# EAGLE design openrfid (EAGLE 6.2)
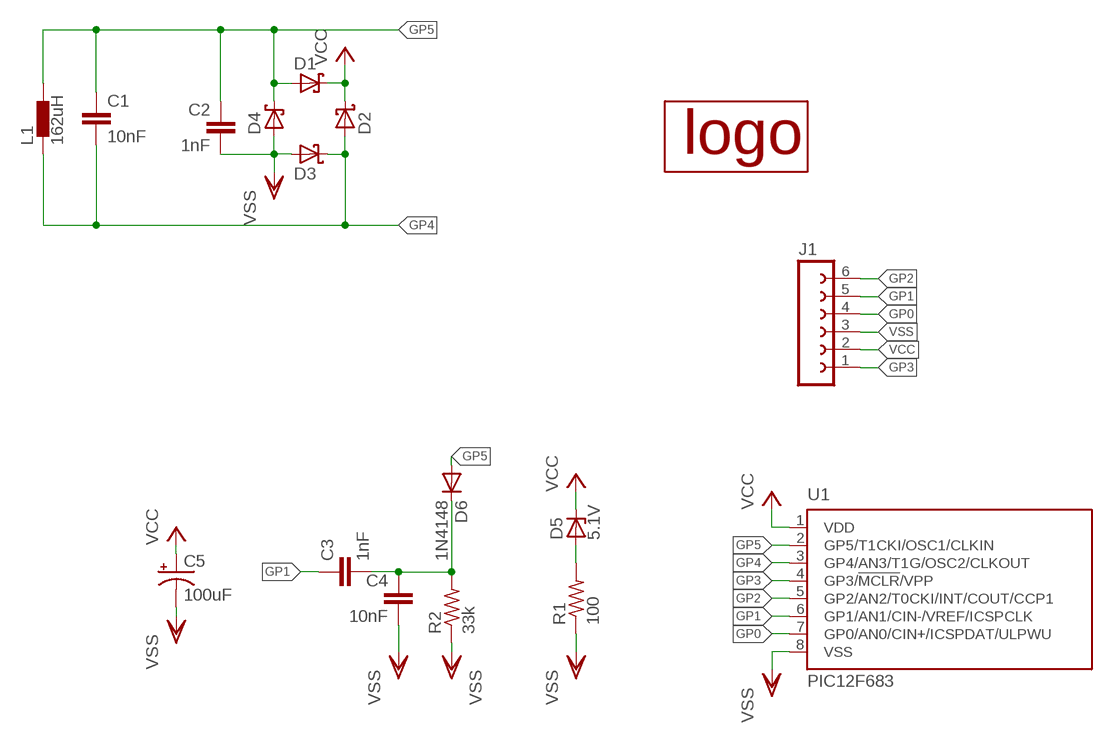
[diagram p0: schematic, sheet 1]

## Parts
C1  10nF  C-EU050-024X044  [C050-024X044]
C2  1nF  C-EU025-024X044  [C025-024X044]
C3  1nF  C-EU025-024X044  [C025-024X044]
C4  10nF  C-EU050-024X044  [C050-024X044]
C5  100uF  CPOL-USE2,5-6E  [E2,5-6E]
D1  1N5817-B  [DO41-7.6]
D2  1N5817-B  [DO41-7.6]
D3  1N5817-B  [DO41-7.6]
D4  1N5817-B  [DO41-7.6]
D5  5.1V  ZENER-DIODEZD-5  [ZDIO-5]
D6  1N4148  1N4148DO35-7  [DO35-7]
J1  FE06-1  [FE06]
L1  162uH  BL02RN2  [BL02RN2]
R1  100  R-US_0204/7  [0204/7]
R2  33k  R-US_0204/7  [0204/7]
U1  PIC12F683  PIC12F683P  [DIL8]
U$1  KBELOGO-SILK  [KBELOGO-SILK]

## Nets
GP0: J1.4 U1.7(GP0/AN0/CIN+/ICSPDAT/ULPWU)
GP1: C3.1 J1.5 U1.6(GP1/AN1/CIN-/VREF/ICSPCLK)
GP2: J1.6 U1.5(GP2/AN2/T0CKI/INT/COUT/CCP1)
GP3: J1.1 U1.4(GP3/!MCLR!/VPP)
GP4: C1.2 D2.A D3.C L1.1 U1.3(GP4/AN3/T1G/OSC2/CLKOUT)
GP5: C1.1 C2.1 D1.A D4.C D6.A L1.2 U1.2(GP5/T1CKI/OSC1/CLKIN)
N$23: D5.A R1.2
N$26: C3.2 C4.1 D6.C R2.2
VCC: C5.+ D1.C D2.C D5.C J1.2 U1.1(VDD)
VSS: C2.2 C4.2 C5.- D3.A D4.A J1.3 R1.1 R2.1 U1.8(VSS)

## Library data of the parts
C1-C4 = rcl:C-EU: CAPACITOR, European symbol
C5 = rcl:CPOL-US: POLARIZED CAPACITOR, American symbol
D1-D4 = diode:1N581*: 1.0A SCHOTTKY BARRIER RECTIFIER Source: http://www.diodes.com/datasheets/ds23001.pdf
D5 = diode:ZENER-DIODE: Z-Diode
D6 = diode:1N4148: DIODE high speed (Philips)
J1 = con-lsta:FE06-1: FEMALE HEADER; OC_FARNELL: unknown; OC_NEWARK: unknown
L1 = inductors:BL0: Noise Suppression Products/EMI Suppression Filters, Lead EMIFIL(R) Inductor Type Source: http://www.murata.com .. BL01RN1_DS.pdf
R1 R2 = rcl:R-US_: RESISTOR, American symbol
U1 = microchip:PIC12F683: 8-Pin Flash-Based, 8-Bit CMOS Microcontrollers with nanoWatt Technology Source: http://ww1.microchip.com/downloads/en/DeviceDoc/41211D_.pdf; MF: MICROCHIP; MPN: PIC12F683-I/P; OC_FARNELL: 9759034; OC_NEWARK: 89H0442
U$1 = cuslibrary:KBELOGO-SILK

## Board
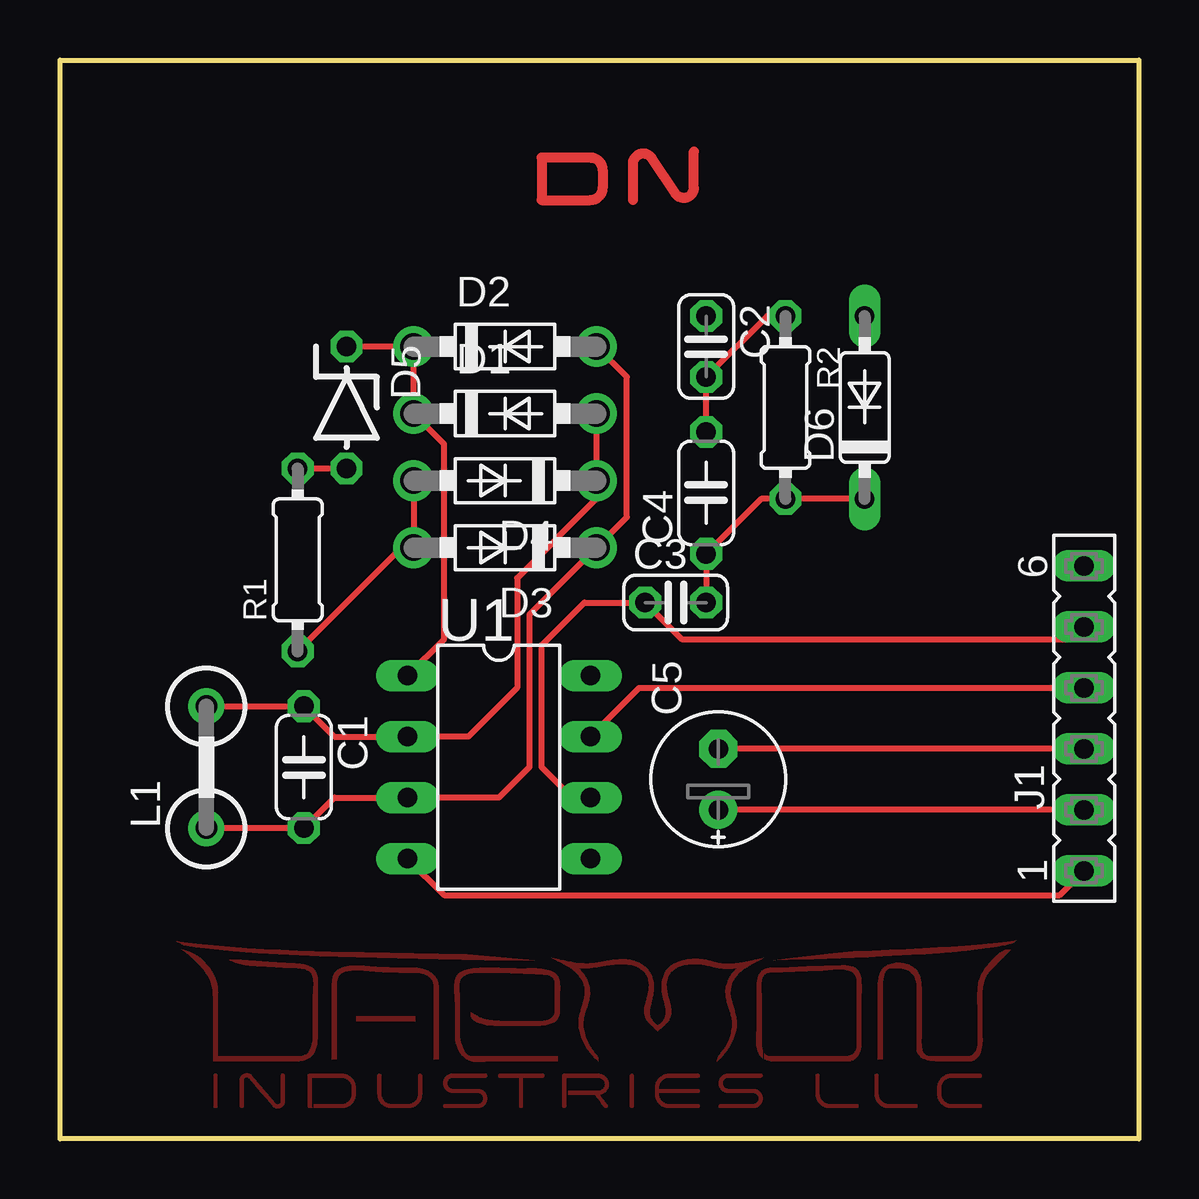
[diagram p1: board, top side]
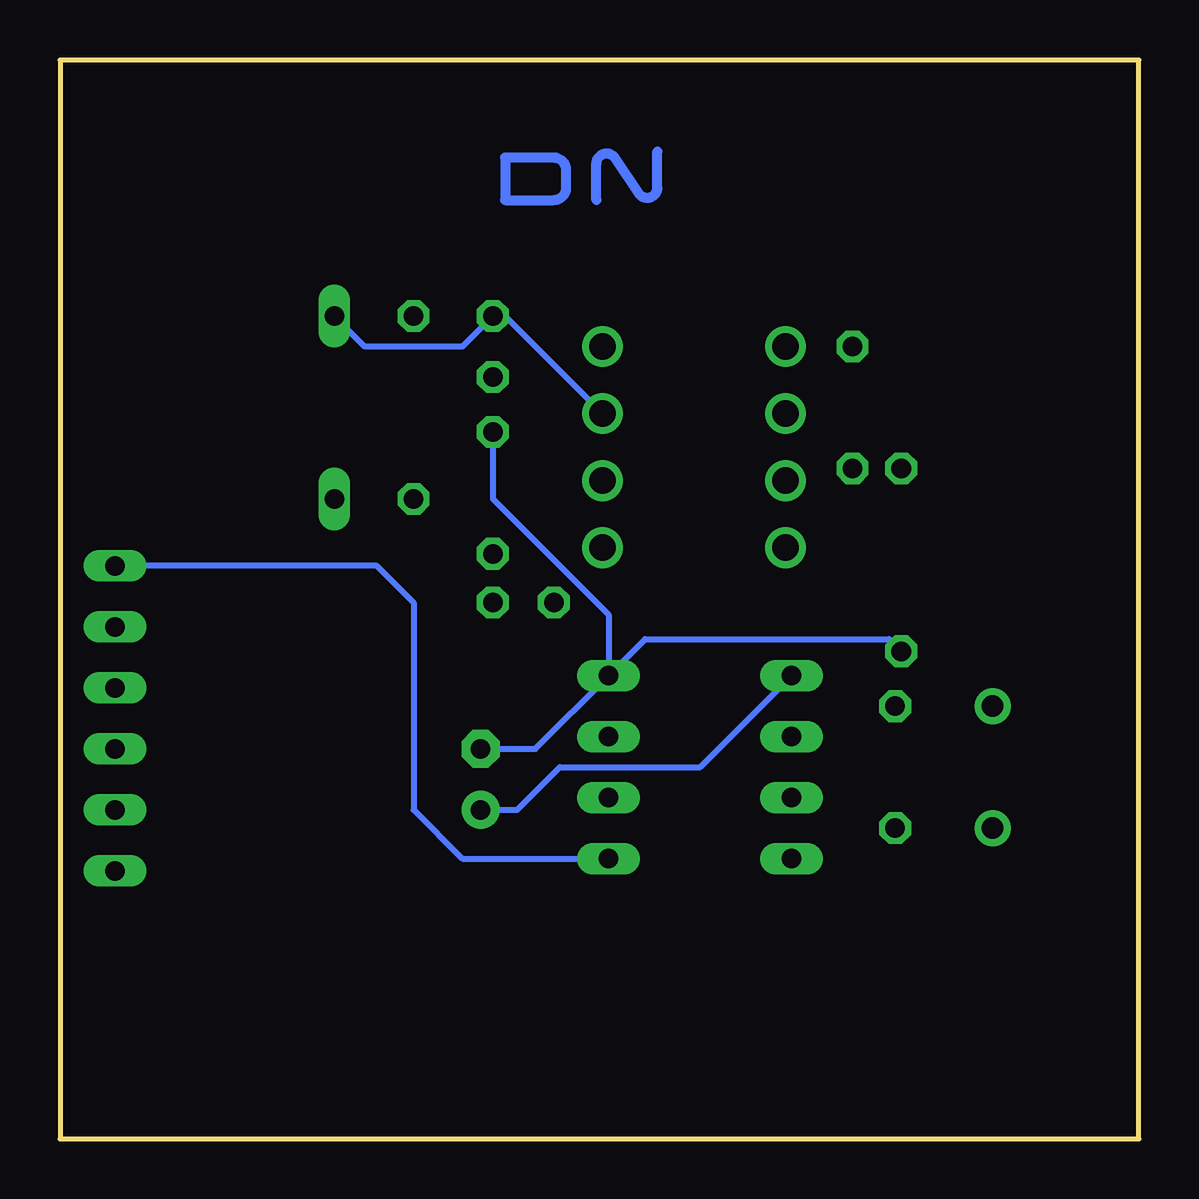
[diagram p2: board, bottom side, seen from below]

Size 44.96 x 44.96 mm. Coordinates in mm from the lower left corner, seen from the top.
Outline: 0,0 0,44.96 44.96,44.96 44.96,0 0,0
Copper layers (1*16): Top 0.035mm / dielectric 1.5mm / Bottom 0.035mm
Design rules: minimum track width 10mil, minimum drill 24mil, track to track 8mil, track to pad 8mil, pad to pad 8mil, via to via 8mil, smd to smd 8mil, copper to edge 40mil, drill to drill 8mil, minimum pad ring 10mil, minimum via ring 8mil, stop-mask expansion 4mil, vias tented up to drill 0mil, thermal gap 10mil

### Footprints (pad centres in the part's own frame; a part is rotated, then mirrored left to right if it is on the bottom)
C050-024X044 = drill 0.813 octagon: 1 -2.54,0; 2 2.54,0
C025-024X044 = drill 0.813 octagon: 1 -1.27,0; 2 1.27,0
E2,5-6E = drill 0.813 pad 1.575: + -1.27,0 | drill 0.813 pad 1.575 octagon: - 1.27,0
DO41-7.6 = drill 1.1 pad 1.7: A 3.81,0; C -3.81,0
ZDIO-5 = drill 0.813 octagon: A 2.54,0; C -2.54,0
DO35-7 = drill 0.813 long: A 3.81,0; C -3.81,0
FE06 = drill 0.813 long: 1 -6.35,0; 2 -3.81,0; 3 -1.27,0; 4 1.27,0; 5 3.81,0; 6 6.35,0
BL02RN2 = drill 0.9 pad 1.5: 1 -2.54,0; 2 2.54,0
0204/7 = drill 0.813 octagon: 1 -3.81,0; 2 3.81,0
DIL8 = drill 0.813 long: 1 -3.81,-3.81; 2 -1.27,-3.81; 3 1.27,-3.81; 4 3.81,-3.81; 5 3.81,3.81; 6 1.27,3.81; 7 -1.27,3.81; 8 -3.81,3.81

### Placement (x,y rotation side)
C1  10.16,15.49 270 top
C2  26.92,33.02 270 top
C3  25.65,22.35 0 top
C4  26.92,26.92 90 top
C5  27.43,14.99 90 top
D1  18.54,30.23 0 top
D2  18.54,33.02 0 top
D3  18.54,24.64 180 top
D4  18.54,27.43 180 top
D5  11.94,30.48 270 top
D6  33.53,30.48 90 top
J1  42.67,17.53 90 top
L1  6.1,15.49 90 top
R1  9.91,24.13 90 top
R2  30.23,30.48 270 top
U1  18.29,15.49 270 top
U$1  26.42,3.3 0 bottom

### Tracks (layer width: path | path; a pad name or v marks a point on that pad's centre or on a via)
GP0
  Top 0.254: U1.7 24.13,18.8 J1.4
GP1
  Top 0.254: U1.6 21.34,14.22 20.07,15.49 20.07,20.57 21.84,22.35 C3.1 25.91,20.83 42.16,20.83 J1.5
GP2
  Bottom 0.254: U1.5 28.19,11.68 30.23,13.72 30.23,22.35 31.75,23.88 J1.6
GP3
  Top 0.254: U1.4 16,10.16 41.66,10.16 J1.1
GP4
  Top 0.254: D2.A 23.62,31.75 23.62,25.91 D3.C 19.56,21.84 19.56,15.49 18.29,14.22 U1.3 11.43,14.22 C1.2 L1.1
GP5
  Top 0.254: D1.A D4.C 22.35,26.67 19.05,23.37 19.05,18.8 17.02,16.76 U1.2 11.43,16.76 C1.1 L1.2
  Bottom 0.254: D6.A 32.26,33.02 28.19,33.02 C2.1 26.42,34.29 D1.A
N$1
  pour Top: 6.49,2.71 6.48,2.71 6.47,2.71 6.47,2.71 6.46,2.71 6.46,2.71 6.45,2.71 6.45,2.71 6.44,2.7 6.44,2.7 6.43,2.7 6.43,2.69 6.43,2.69 6.42,2.69 6.42,2.68 6.42,2.68 6.41,2.67 6.41,2.67 6.41,2.67 6.41,2.66 6.41,2.66 6.4,2.65 6.4,2.64 6.4,1.36 6.4,1.36 6.41,1.35 6.41,1.35 6.41,1.34 6.41,1.34 6.41,1.34 6.41,1.33 6.42,1.33 6.42,1.32 6.42,1.32 6.43,1.31 6.43,1.31 6.43,1.31 6.44,1.31 6.44,1.3 6.45,1.3 6.45,1.3 6.46,1.3 6.46,1.29 6.47,1.29 6.47,1.29 6.48,1.29 6.49,1.29 6.49,1.29 6.5,1.29 6.5,1.29 6.51,1.3 6.51,1.3 6.52,1.3 6.52,1.3 6.53,1.31 6.53,1.31 6.53,1.31 6.54,1.31 6.54,1.32 6.54,1.32 6.55,1.33 6.55,1.33 6.55,1.34 6.55,1.34 6.56,1.34 6.56,1.35 6.56,1.35 6.56,1.36 6.56,1.36 6.56,2.64 6.56,2.65 6.56,2.65 6.56,2.66 6.56,2.66 6.55,2.67 6.55,2.67 6.55,2.67 6.55,2.68 6.54,2.68 6.54,2.69 6.53,2.69 6.53,2.7 6.53,2.7 6.52,2.7 6.52,2.71 6.51,2.71 6.51,2.71 6.5,2.71 6.5,2.71 6.49,2.71
N$2
  pour Top: 345 corners
N$3
  pour Top: 270 corners
N$4
  pour Top: 433 corners
N$5
  pour Top: 20.11,2.71 18.33,2.71 18.32,2.71 18.32,2.71 18.31,2.71 18.31,2.71 18.3,2.71 18.3,2.71 18.29,2.7 18.29,2.7 18.29,2.7 18.28,2.69 18.27,2.69 18.27,2.68 18.27,2.68 18.27,2.67 18.26,2.67 18.26,2.67 18.26,2.66 18.26,2.66 18.26,2.65 18.26,2.65 18.26,2.64 18.26,2.63 18.26,2.62 18.26,2.62 18.26,2.61 18.26,2.61 18.26,2.61 18.26,2.6 18.27,2.6 18.27,2.59 18.27,2.59 18.27,2.58 18.28,2.58 18.29,2.57 18.29,2.57 18.29,2.57 18.3,2.56 18.3,2.56 18.31,2.56 18.31,2.56 18.32,2.56 18.32,2.56 18.33,2.56 19.13,2.56 19.13,1.36 19.13,1.36 19.13,1.35 19.13,1.35 19.13,1.34 19.13,1.34 19.13,1.34 19.14,1.33 19.14,1.33 19.14,1.32 19.15,1.32 19.15,1.31 19.15,1.31 19.16,1.31 19.16,1.31 19.17,1.3 19.17,1.3 19.18,1.3 19.18,1.29 19.19,1.29 19.19,1.29 19.2,1.29 19.21,1.29 19.22,1.29 19.22,1.29 19.23,1.29 19.23,1.3 19.24,1.3 19.24,1.3 19.24,1.3 19.25,1.31 19.25,1.31 19.26,1.31 19.26,1.31 19.26,1.32 19.27,1.32 19.27,1.33 19.27,1.33 19.28,1.34 19.28,1.34 19.28,1.34 19.28,1.35 19.28,1.35 19.28,1.36 19.28,1.36 19.28,2.56 20.11,2.56 20.12,2.56 20.12,2.56 20.13,2.56 20.13,2.56 20.14,2.56 20.14,2.56 20.15,2.57 20.15,2.57 20.16,2.57 20.16,2.58 20.16,2.58 20.17,2.58 20.17,2.59 20.17,2.59 20.18,2.6 20.18,2.6 20.18,2.61 20.18,2.61 20.18,2.62 20.18,2.62 20.19,2.63 20.19,2.64 20.18,2.65 20.18,2.65 20.18,2.66 20.18,2.66 20.18,2.67 20.18,2.67 20.18,2.67 20.17,2.68 20.17,2.68 20.17,2.69 20.16,2.69 20.16,2.69 20.16,2.7 20.15,2.7 20.15,2.7 20.14,2.71 20.14,2.71 20.13,2.71 20.13,2.71 20.12,2.71 20.12,2.71
N$6
  pour Top: 23.83,2.71 23.82,2.71 23.81,2.71 23.81,2.71 23.8,2.71 23.8,2.71 23.79,2.71 23.79,2.71 23.79,2.7 23.78,2.7 23.78,2.7 23.77,2.69 23.77,2.69 23.76,2.68 23.76,2.68 23.76,2.67 23.75,2.67 23.75,2.67 23.75,2.66 23.75,2.66 23.75,2.65 23.75,2.65 23.75,2.64 23.75,1.36 23.75,1.36 23.75,1.35 23.75,1.35 23.75,1.34 23.75,1.34 23.75,1.34 23.76,1.33 23.76,1.33 23.76,1.32 23.77,1.32 23.77,1.31 23.77,1.31 23.78,1.31 23.78,1.31 23.79,1.3 23.79,1.3 23.8,1.3 23.8,1.29 23.81,1.29 23.81,1.29 23.82,1.29 23.83,1.29 23.84,1.29 23.84,1.29 23.85,1.29 23.85,1.3 23.86,1.3 23.86,1.3 23.86,1.3 23.87,1.31 23.87,1.31 23.88,1.31 23.88,1.31 23.88,1.32 23.89,1.32 23.89,1.33 23.89,1.33 23.9,1.34 23.9,1.34 23.9,1.34 23.9,1.35 23.9,1.35 23.9,1.36 23.9,1.36 23.9,2.64 23.9,2.65 23.9,2.65 23.9,2.66 23.9,2.66 23.9,2.67 23.9,2.67 23.89,2.67 23.89,2.68 23.89,2.68 23.88,2.69 23.88,2.69 23.88,2.69 23.87,2.7 23.87,2.7 23.86,2.7 23.86,2.71 23.86,2.71 23.85,2.71 23.85,2.71 23.84,2.71 23.84,2.71
N$7
  pour Top: 316 corners
N$8
  pour Top: 426 corners
N$9
  pour Top: 33.2,1.45 32.06,1.45 32.04,1.45 32.03,1.45 32.01,1.45 32,1.45 31.99,1.46 31.97,1.46 31.96,1.46 31.95,1.47 31.93,1.47 31.92,1.48 31.91,1.48 31.89,1.49 31.88,1.49 31.87,1.5 31.86,1.51 31.85,1.51 31.82,1.53 31.81,1.54 31.8,1.55 31.79,1.56 31.78,1.57 31.77,1.58 31.76,1.58 31.75,1.59 31.74,1.61 31.73,1.62 31.73,1.63 31.72,1.64 31.71,1.65 31.7,1.66 31.7,1.67 31.69,1.68 31.68,1.7 31.68,1.71 31.67,1.72 31.67,1.74 31.66,1.75 31.66,1.76 31.66,1.78 31.65,1.8 31.65,1.82 31.65,1.83 31.65,1.85 31.65,1.86 31.65,2.64 31.64,2.65 31.64,2.66 31.64,2.66 31.64,2.67 31.64,2.67 31.64,2.67 31.63,2.68 31.63,2.68 31.63,2.69 31.62,2.69 31.61,2.7 31.61,2.7 31.61,2.7 31.6,2.71 31.6,2.71 31.59,2.71 31.59,2.71 31.58,2.71 31.58,2.71 31.57,2.71 31.56,2.71 31.56,2.71 31.55,2.71 31.55,2.71 31.54,2.71 31.54,2.71 31.53,2.71 31.53,2.7 31.52,2.7 31.52,2.7 31.52,2.69 31.51,2.69 31.51,2.69 31.5,2.68 31.5,2.68 31.5,2.67 31.5,2.67 31.5,2.67 31.49,2.66 31.49,2.66 31.49,2.65 31.49,2.65 31.49,2.64 31.49,1.86 31.49,1.84 31.49,1.82 31.49,1.8 31.5,1.78 31.5,1.74 31.51,1.72 31.52,1.7 31.52,1.68 31.53,1.67 31.54,1.63 31.55,1.61 31.56,1.6 31.57,1.58 31.58,1.56 31.59,1.55 31.6,1.53 31.61,1.52 31.62,1.51 31.63,1.49 31.65,1.48 31.67,1.45 31.69,1.44 31.7,1.43 31.72,1.41 31.73,1.4 31.75,1.39 31.76,1.38 31.78,1.37 31.79,1.36 31.81,1.35 31.83,1.35 31.85,1.34 31.86,1.33 31.88,1.32 31.9,1.32 31.92,1.31 31.94,1.31 31.97,1.3 31.99,1.3 32.01,1.3 32.03,1.29 32.05,1.29 33.2,1.29 33.2,1.29 33.21,1.29 33.21,1.29 33.22,1.3 33.23,1.3 33.23,1.3 33.23,1.31 33.24,1.31 33.24,1.31 33.25,1.31 33.25,1.32 33.25,1.32 33.26,1.33 33.26,1.33 33.26,1.34 33.26,1.34 33.27,1.34 33.27,1.35 33.27,1.35 33.27,1.36 33.27,1.36 33.27,1.38 33.27,1.38 33.27,1.39 33.27,1.39 33.27,1.4 33.26,1.4 33.26,1.41 33.26,1.41 33.26,1.41 33.25,1.42 33.25,1.42 33.25,1.43 33.24,1.43 33.24,1.43 33.23,1.44 33.23,1.44 33.23,1.44 33.22,1.44 33.21,1.45 33.21,1.45 33.2,1.45
N$10
  pour Top: 35.66,1.45 34.52,1.45 34.5,1.45 34.49,1.45 34.47,1.45 34.46,1.45 34.44,1.46 34.43,1.46 34.42,1.46 34.4,1.47 34.39,1.47 34.38,1.48 34.37,1.48 34.35,1.49 34.34,1.49 34.33,1.5 34.32,1.51 34.3,1.51 34.29,1.52 34.28,1.53 34.27,1.54 34.26,1.55 34.25,1.56 34.24,1.57 34.23,1.58 34.22,1.58 34.21,1.59 34.2,1.61 34.19,1.62 34.18,1.63 34.18,1.64 34.17,1.65 34.16,1.66 34.15,1.67 34.15,1.68 34.14,1.7 34.14,1.71 34.13,1.72 34.13,1.74 34.12,1.75 34.12,1.76 34.11,1.78 34.11,1.8 34.11,1.82 34.11,1.83 34.1,1.85 34.1,1.86 34.1,2.64 34.1,2.65 34.1,2.65 34.1,2.66 34.1,2.66 34.1,2.67 34.1,2.67 34.09,2.67 34.09,2.68 34.09,2.68 34.08,2.69 34.08,2.69 34.07,2.7 34.07,2.7 34.07,2.7 34.06,2.71 34.06,2.71 34.05,2.71 34.05,2.71 34.04,2.71 34.04,2.71 34.03,2.71 34.02,2.71 34.02,2.71 34.01,2.71 34.01,2.71 34,2.71 34,2.71 33.99,2.71 33.99,2.7 33.98,2.7 33.98,2.7 33.97,2.69 33.97,2.69 33.97,2.69 33.96,2.68 33.96,2.68 33.96,2.67 33.96,2.67 33.95,2.67 33.95,2.66 33.95,2.66 33.95,2.65 33.95,2.65 33.95,2.64 33.95,1.86 33.95,1.84 33.95,1.82 33.95,1.8 33.96,1.78 33.96,1.76 33.96,1.74 33.97,1.72 33.97,1.7 33.98,1.68 33.99,1.67 33.99,1.65 34,1.63 34.01,1.61 34.02,1.6 34.03,1.58 34.04,1.56 34.05,1.55 34.06,1.53 34.07,1.52 34.08,1.51 34.09,1.49 34.11,1.48 34.13,1.45 34.15,1.44 34.16,1.43 34.17,1.41 34.19,1.4 34.2,1.39 34.22,1.38 34.24,1.37 34.25,1.36 34.27,1.35 34.29,1.35 34.3,1.34 34.32,1.33 34.34,1.32 34.36,1.32 34.38,1.31 34.39,1.31 34.43,1.3 34.45,1.3 34.47,1.3 34.49,1.29 34.51,1.29 35.66,1.29 35.66,1.29 35.67,1.29 35.67,1.29 35.68,1.3 35.68,1.3 35.68,1.3 35.69,1.3 35.69,1.31 35.7,1.31 35.7,1.31 35.71,1.31 35.71,1.32 35.71,1.32 35.72,1.33 35.72,1.33 35.72,1.34 35.72,1.34 35.72,1.34 35.73,1.35 35.73,1.35 35.73,1.36 35.73,1.36 35.73,1.38 35.73,1.38 35.73,1.39 35.72,1.4 35.72,1.4 35.72,1.41 35.72,1.41 35.72,1.41 35.71,1.42 35.71,1.42 35.71,1.43 35.7,1.43 35.7,1.43 35.69,1.44 35.69,1.44 35.68,1.44 35.68,1.44 35.68,1.44 35.67,1.45 35.67,1.45 35.66,1.45
N$11
  pour Top: 269 corners
N$12
  pour Top: 696 corners
N$13
  pour Top: 503 corners
N$14
  pour Top: 245 corners
N$15
  pour Top: 14.79,5.11 14.18,5.11 13.57,5.11 12.96,5.11 12.34,5.11 12.34,5.06 12.34,5.01 12.34,4.96 12.34,4.91 12.96,4.91 13.57,4.91 14.18,4.91 14.79,4.91 14.79,4.96 14.79,5.01 14.79,5.06
N$16
  pour Top: 270 corners
N$17
  pour Top: 374 corners
N$18
  pour Top: 39.75,8.27 39.46,8.22 39.09,8.18 38.66,8.14 38.22,8.1 37.71,8.06 37.15,8.02 36.58,7.98 35.95,7.95 35.26,7.91 34.58,7.88 33.83,7.85 33.04,7.82 32.22,7.73 30.57,7.55 29.75,7.45 29.75,7.45 29.76,7.45 29.76,7.45 29.77,7.45 29.77,7.45 29.78,7.46 29.78,7.46 29.79,7.46 29.79,7.46 29.79,7.46 29.8,7.46 29.8,7.46 30.32,7.47 30.85,7.48 31.4,7.5 31.95,7.51 32.52,7.53 33.1,7.56 33.68,7.58 34.27,7.61 35.46,7.67 36.06,7.71 36.66,7.75 36.83,7.76 36.99,7.77 37.13,7.79 37.27,7.8 37.4,7.81 37.53,7.82 37.65,7.84 37.79,7.85 37.93,7.87 38.07,7.89 38.23,7.91 38.41,7.94 38.42,7.94 38.5,7.95 38.62,7.96 38.74,7.97 38.9,7.99 39.05,8.02 39.21,8.04 39.38,8.07 39.51,8.11 39.64,8.14 39.74,8.18 39.78,8.22 39.79,8.23 39.81,8.25 39.82,8.26 39.83,8.28 39.81,8.28 39.77,8.27
N$19
  pour Top: 16.96,7.69 16.96,7.69 16.96,7.69 16.96,7.69 16.96,7.69 16.88,7.69 16.8,7.69 16.72,7.69 16.64,7.69 16.56,7.7 16.47,7.7 16.39,7.7 16.31,7.7 16.23,7.7 16.15,7.7 16.07,7.7 15.99,7.7 15.95,7.71 15.89,7.71 15.83,7.71 15.77,7.71 15.69,7.71 15.62,7.71 15.54,7.71 15.46,7.71 15.38,7.72 15.3,7.72 15.21,7.72 15.13,7.72 15.05,7.72 14.97,7.73 14.89,7.73 14.82,7.73 14.75,7.73 14.69,7.73 14.63,7.73 14.58,7.73 14.55,7.73 14.51,7.73 14.49,7.73 14.48,7.73 14.48,7.73 14.39,7.74 14.3,7.74 14.21,7.74 14.11,7.74 14.02,7.74 13.93,7.75 13.84,7.75 13.74,7.75 13.56,7.75 13.46,7.76 13.37,7.76 12.68,7.77 11.99,7.79 11.29,7.8 10.59,7.82 9.89,7.85 9.18,7.88 8.48,7.91 7.78,7.95 7.08,8.01 6.38,8.07 5.68,8.13 4.99,8.22 4.95,8.23 4.91,8.23 4.87,8.24 4.83,8.24 4.87,8.22 4.9,8.21 4.94,8.19 4.97,8.17 5.16,8.07 5.66,7.98 6.44,7.9 7.21,7.82 8.26,7.74 9.55,7.68 10.83,7.62 12.35,7.56 14.07,7.52 15.78,7.48 17.69,7.45 19.76,7.44 19.06,7.5 18.36,7.56 17.66,7.63
N$20
  pour Top: 270 corners
N$21
  pour Top: 303 corners
N$22
  pour Top: 238 corners
N$23
  Top 0.254: R1.2 D5.A
N$24
  Top 0.406: 20.07,40.89 20.07,39.12 22.1,39.12 arc90 22.61,39.62 22.61,40.39 arc90 22.1,40.89 20.07,40.89
N$25
  Top 0.406: 23.88,39.12 23.88,40.64 arc-143 24.64,40.89 25.65,39.37 arc137 26.42,39.62 26.42,41.15
N$26
  Top 0.254: D6.C R2.2 29.21,26.67 C4.1 C3.2
N$27
  Bottom 0.406: 26.42,40.89 26.42,39.12 24.38,39.12 arc-90 23.88,39.62 23.88,40.39 arc-90 24.38,40.89 26.42,40.89
N$28
  Bottom 0.406: 22.61,39.12 22.61,40.64 arc143 21.84,40.89 20.83,39.37 arc-137 20.07,39.62 20.07,41.15
VCC
  Top 0.254: D5.C D2.C D1.C 16,28.96 16,20.83 U1.1 | J1.2 C5.+
  Bottom 0.254: C5.+ 25.91,13.72 24.13,15.49 18.29,15.49 U1.1
VSS
  Top 0.254: D4.A D3.A 14.22,24.64 R1.1 | J1.3 C5.- | R2.1 29.46,34.29 C2.2 C4.2
  Bottom 0.254: U1.8 20.57,20.83 10.41,20.83 R1.1 | C5.- 25.15,16.26 U1.8 | C4.2 26.92,26.67 22.1,21.84 U1.8

### Text on the board
tTest: http://dcdark.net | Assembly No: | DCDN-RFID-0x8008 | Rev 1.4 | C2 | R2 | D2 | D5 | D1 | D6 | D4 | C4 | R1 | D3 | U1 | C3 | J1 | L1 | C1 | C5 | PICkit2/3 Header | PIC12F683
bTest: www.KBEmbedded.com